# EAGLE design scs (EAGLE 6.3)
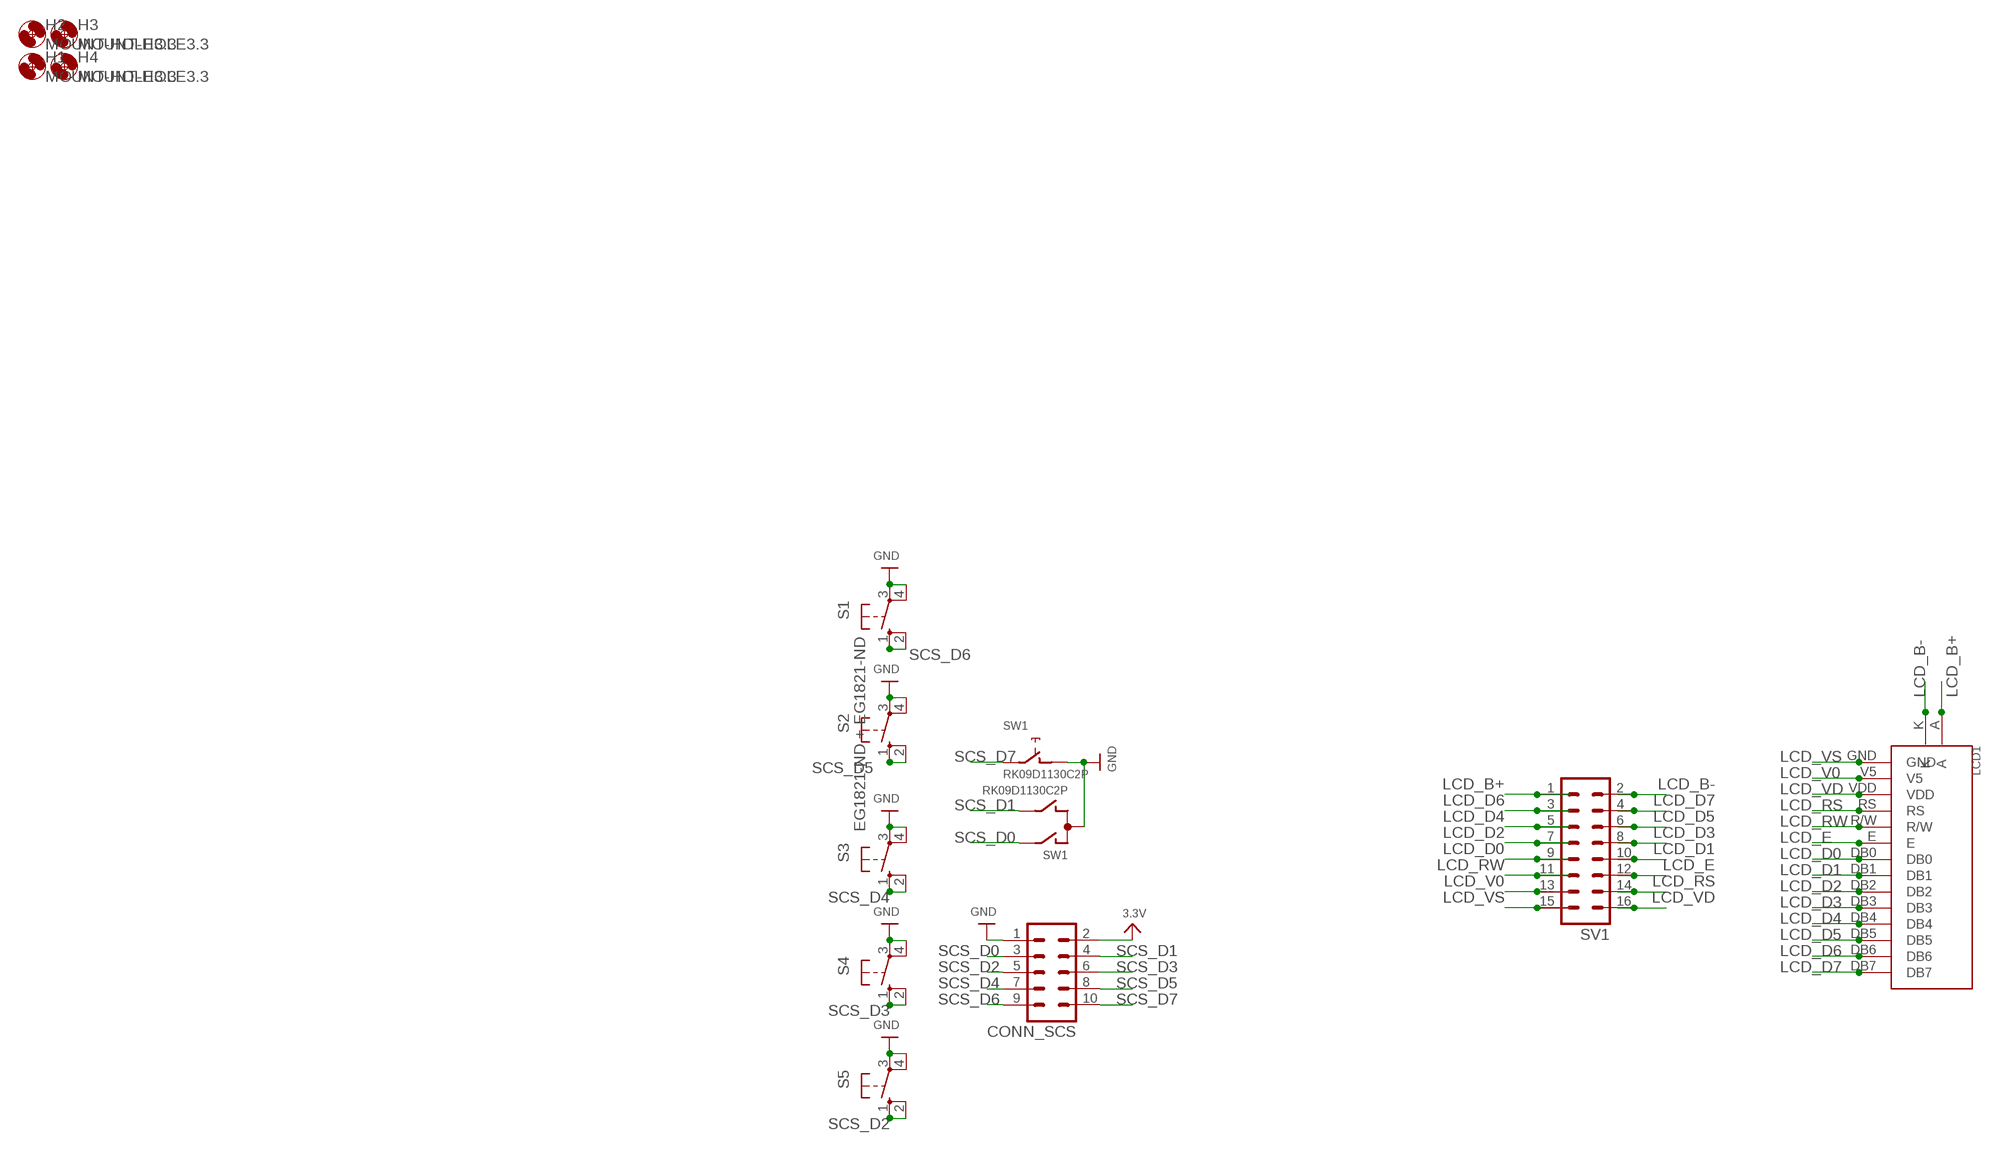
[diagram p0: schematic, sheet 1]

## Parts
CONN_SCS  ML10  [ML10]
H1  MOUNT-HOLE3.3  [3,3]
H2  MOUNT-HOLE3.3  [3,3]
H3  MOUNT-HOLE3.3  [3,3]
H4  MOUNT-HOLE3.3  [3,3]
LCD1  NHD-C0220AA-FSW-FTW  [NHD-C0220AA-FSW-FTW]
S1  EG1821-ND + EG1821-ND  40-XX  [B3F-40XX]
S2  40-XX  [B3F-40XX]
S3  40-XX  [B3F-40XX]
S4  40-XX  [B3F-40XX]
S5  40-XX  [B3F-40XX]
SV1  ML16  [ML16]
SW1  RK09D1130C2P  EC12E_SW  [ALPS_EC12E_SW]

## Nets
3.3V: CONN_SCS.2
GND: CONN_SCS.1 S1.3(P) S1.4(P1) S2.3(P) S2.4(P1) S3.3(P) S3.4(P1) S4.3(P) S4.4(P1) S5.3(P) S5.4(P1) SW1.C SW1.D
LCD_B+: LCD1.A SV1.1
LCD_B-: LCD1.K SV1.2
LCD_D0: LCD1.DB0 SV1.9
LCD_D1: LCD1.DB1 SV1.10
LCD_D2: LCD1.DB2 SV1.7
LCD_D3: LCD1.DB3 SV1.8
LCD_D4: LCD1.DB4 SV1.5
LCD_D5: LCD1.DB5 SV1.6
LCD_D6: LCD1.DB6 SV1.3
LCD_D7: LCD1.DB7 SV1.4
LCD_E: LCD1.E SV1.12
LCD_RS: LCD1.RS SV1.14
LCD_RW: LCD1.R/W SV1.11
LCD_V0: LCD1.V5 SV1.13
LCD_VD: LCD1.VDD SV1.16
LCD_VS: LCD1.GND SV1.15
SCS_D0: CONN_SCS.3 SW1.A
SCS_D1: CONN_SCS.4 SW1.B
SCS_D2: CONN_SCS.5 S5.1(S) S5.2(S1)
SCS_D3: CONN_SCS.6 S4.1(S) S4.2(S1)
SCS_D4: CONN_SCS.7 S3.1(S) S3.2(S1)
SCS_D5: CONN_SCS.8 S2.1(S) S2.2(S1)
SCS_D6: CONN_SCS.9 S1.1(S) S1.2(S1)
SCS_D7: CONN_SCS.10 SW1.E
Unconnected: SW1.GND1(G) SW1.GND2(G)

## Library data of the parts
CONN_SCS = con-harting-ml:ML10: HARTING; OC_FARNELL: unknown; OC_NEWARK: unknown
H1-H4 = holes:MOUNT-HOLE: MOUNTING HOLE with drill center marker
LCD1 = NHD-C0220AA-FSW-FTW:NHD-C0220AA-FSW-FTW: NHD-C0220AA-FSW-FTW http://www.newhavendisplay.com/specs/NHD-C0220AA-FSW-FTW.pdf COG (Chip-on-Glass) Liquid Crystal Display Module NHD Newhaven Display C0220 COG, 2 lines x 20 characters AA Model F Transflective SW Side White LED backlight F FSTN+ T 12:00 View Angle W Wide Temp (‐20°C ~ +70°C) RoHS Compliant www.newhavendisplay.com
S1-S5 = og-switch:40-XX: OMRON SWITCH
SV1 = con-harting-ml:ML16: HARTING; OC_FARNELL: unknown; OC_NEWARK: unknown
SW1 = switch-alps:EC12E_SW: ALPS rotary Encoder EC12E series with switch

## Board
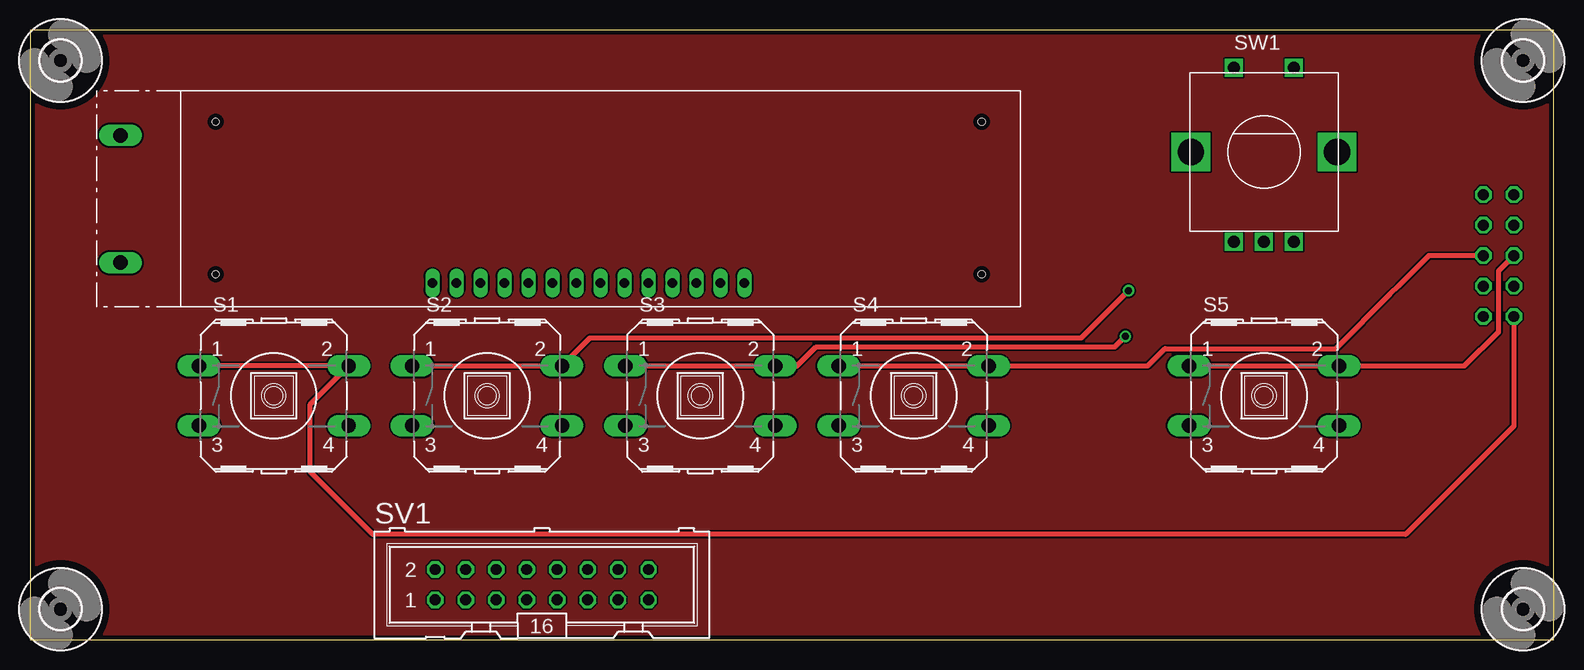
[diagram p1: board, top side]
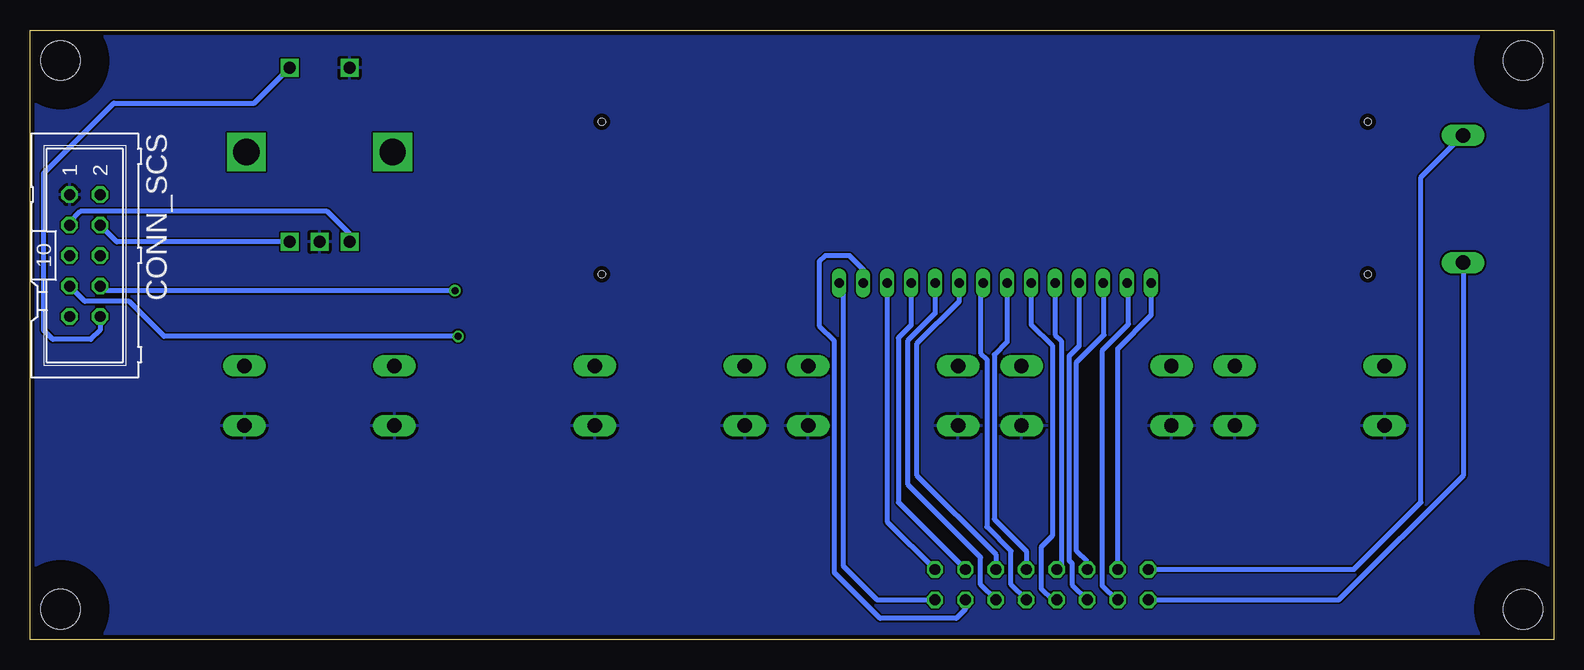
[diagram p2: board, bottom side, seen from below]

Size 127 x 50.8 mm. Coordinates in mm from the lower left corner, seen from the top.
Outline: 0,0 127,0 127,50.8 0,50.8 0,0
Copper layers (1*16): Top 0.0356mm / dielectric 1.5011mm / Bottom 0.0356mm
Design rules "oshpark_2layer": minimum track width 6mil, minimum drill 13mil, track to track 6mil, track to pad 6mil, pad to pad 6mil, via to via 6mil, smd to smd 6mil, copper to edge 15mil, drill to drill 6mil, minimum pad ring 7mil, minimum via ring 7mil, stop-mask expansion 3mil, vias tented up to drill 0mil, thermal gap 10mil

### Footprints (pad centres in the part's own frame; a part is rotated, then mirrored left to right if it is on the bottom)
ML10 = drill 0.914 octagon: 1 -5.08,-1.27; 2 -5.08,1.27; 3 -2.54,-1.27; 4 -2.54,1.27; 5 0,-1.27; 6 0,1.27; 7 2.54,-1.27; 8 2.54,1.27; 9 5.08,-1.27; 10 5.08,1.27
3,3 = hole 3.3: 0,0
NHD-C0220AA-FSW-FTW = drill 1.2 long: A 75,14.3; K 75,3.7 | drill 0.8 long: DB0 35,16; DB1 37,16; DB2 39,16; DB3 41,16; DB4 43,16; DB5 45,16; DB6 47,16; DB7 49,16; E 33,16; GND 23,16; R/W 31,16; RS 29,16; V5 25,16; VDD 27,16 | hole 0.6: 3.22,15.27; 3.22,2.57; 67.07,2.57; 67.07,15.27
B3F-40XX = drill 1.194 long: 1 -6.248,2.489; 2 6.248,2.489; 3 -6.248,-2.489; 4 6.248,-2.489
ML16 = drill 0.914 octagon: 1 -8.89,-1.27; 2 -8.89,1.27; 3 -6.35,-1.27; 4 -6.35,1.27; 5 -3.81,-1.27; 6 -3.81,1.27; 7 -1.27,-1.27; 8 -1.27,1.27; 9 1.27,-1.27; 10 1.27,1.27; 11 3.81,-1.27; 12 3.81,1.27; 13 6.35,-1.27; 14 6.35,1.27; 15 8.89,-1.27; 16 8.89,1.27
ALPS_EC12E_SW = drill 1 square: A -2.5,-7.5; B 2.5,-7.5; C 0,-7.5; D -2.5,7; E 2.5,7 | drill 2.2 square: GND1 -6.1,0; GND2 6.1,0

### Placement (x,y rotation side)
CONN_SCS  122.43,32 270 bottom
H1  2.54,48.26 0 top
H2  124.46,48.26 0 top
H3  2.54,2.54 0 top
H4  124.46,2.54 0 top
LCD1  82.55,45.72 180 top
S1  20.32,20.32 0 top
S2  38.1,20.32 0 top
S3  55.88,20.32 0 top
S4  73.66,20.32 0 top
S5  102.87,20.32 0 top
SV1  42.67,4.57 0 top
SW1  102.87,40.64 0 top

### Tracks (layer width: path | path; a pad name or v marks a point on that pad's centre or on a via)
5.0V
  pour Top: 0.25,50.55 126.75,50.55 126.75,0.25 0.25,0.25
GND
  pour Bottom: 0.25,50.55 126.75,50.55 126.75,0.25 0.25,0.25
LCD_B+
  Bottom 0.406: SV1.1 17.91,3.3 7.49,13.72 7.49,31.36 LCD1.A
LCD_B-
  Bottom 0.406: SV1.2 16.64,5.84 11.05,11.43 11.05,38.52 LCD1.K
LCD_D0
  Bottom 0.406: LCD1.DB0 47.55,29.67 47.75,29.46 47.75,23.88 47.24,23.37 47.24,9.4 45.21,7.37 45.21,4.57 SV1.9
LCD_D1
  Bottom 0.406: LCD1.DB1 45.55,24.81 46.61,23.75 46.61,10.03 43.94,7.37 SV1.10
LCD_D2
  Bottom 0.406: LCD1.DB2 43.55,26.28 41.78,24.51 41.78,8.64 42.67,7.75 42.67,4.19 41.78,3.3 SV1.7
LCD_D3
  Bottom 0.406: LCD1.DB3 41.55,25.42 41.02,24.89 41.02,6.22 SV1.8
LCD_D4
  Bottom 0.406: LCD1.DB4 39.55,24.46 40.39,23.62 40.39,6.6 40.13,6.35 40.13,4.57 SV1.5
LCD_D5
  Bottom 0.406: SV1.6 38.86,6.48 39.75,7.37 39.75,23.11 37.47,25.4 37.47,29.64 LCD1.DB5
LCD_D6
  Bottom 0.406: SV1.3 36.45,3.3 37.59,4.45 37.59,24.13 35.43,26.29 35.43,29.6 LCD1.DB6
LCD_D7
  Bottom 0.406: SV1.4 36.32,24.26 33.53,27.05 33.53,29.7 LCD1.DB7
LCD_E
  Bottom 0.406: LCD1.E 49.55,28.17 53.09,24.64 53.09,13.72 46.48,7.11 SV1.12
LCD_RS
  Bottom 0.406: LCD1.RS 53.55,26.21 54.61,25.15 54.61,11.43 SV1.14
LCD_RW
  Bottom 0.406: LCD1.R/W 51.55,27.19 53.85,24.89 53.85,12.95 47.75,6.86 47.75,4.57 SV1.11
LCD_V0
  Bottom 0.406: SV1.13 49.02,2.54 49.78,1.78 56.13,1.78 59.94,5.59 59.94,24.89 61.21,26.16 61.21,31.5 60.71,32 58.67,32 57.55,30.88 LCD1.V5
LCD_VD
  Bottom 0.406: LCD1.VDD 55.55,9.83 SV1.16
LCD_VS
  Bottom 0.406: SV1.15 56.39,3.3 59.18,6.1 59.18,29.35 LCD1.GND
SCS_D0
  Bottom 0.406: SW1.A 100.37,33.82 102.23,35.69 122.81,35.69 123.7,34.8 CONN_SCS.3
SCS_D1
  Bottom 0.406: SW1.B 119.75,33.14 CONN_SCS.4
SCS_D2
  Top 0.406: S5.1 S5.2 119.58,22.81 122.43,25.65 122.43,30.73 CONN_SCS.5
SCS_D3
  Top 0.406: S4.1 S4.2 93.17,22.81 94.61,24.26 108.84,24.26 113.41,28.83 114.05,29.46 116.59,32 CONN_SCS.6
SCS_D4  (via drill 0.6)
  Top 0.406: S3.1 S3.2 63.96,22.81 65.53,24.38 90.42,24.38 v91.31,25.27
  Bottom 0.406: v91.31,25.27 115.82,25.27 118.75,28.19 122.43,28.19 CONN_SCS.7
SCS_D5  (via drill 0.6)
  Top 0.406: S2.1 S2.2 46.69,25.15 87.63,25.15 v91.57,29.08
  Bottom 0.406: v91.57,29.08 120.78,29.08 CONN_SCS.8
SCS_D6
  Top 0.406: CONN_SCS.9 123.7,17.78 114.68,8.76 28.57,8.76 23.37,13.97 23.37,19.61 S1.2 S1.1
SCS_D7
  Bottom 0.406: CONN_SCS.10 121.16,25.78 121.92,25.02 125.09,25.02 125.86,25.78 125.86,38.86 120.02,44.7 108.31,44.7 SW1.E